# Altium schematic sheet CONNECTION.SchDoc
size A; SheetNumber: 1; SheetTotal: 2
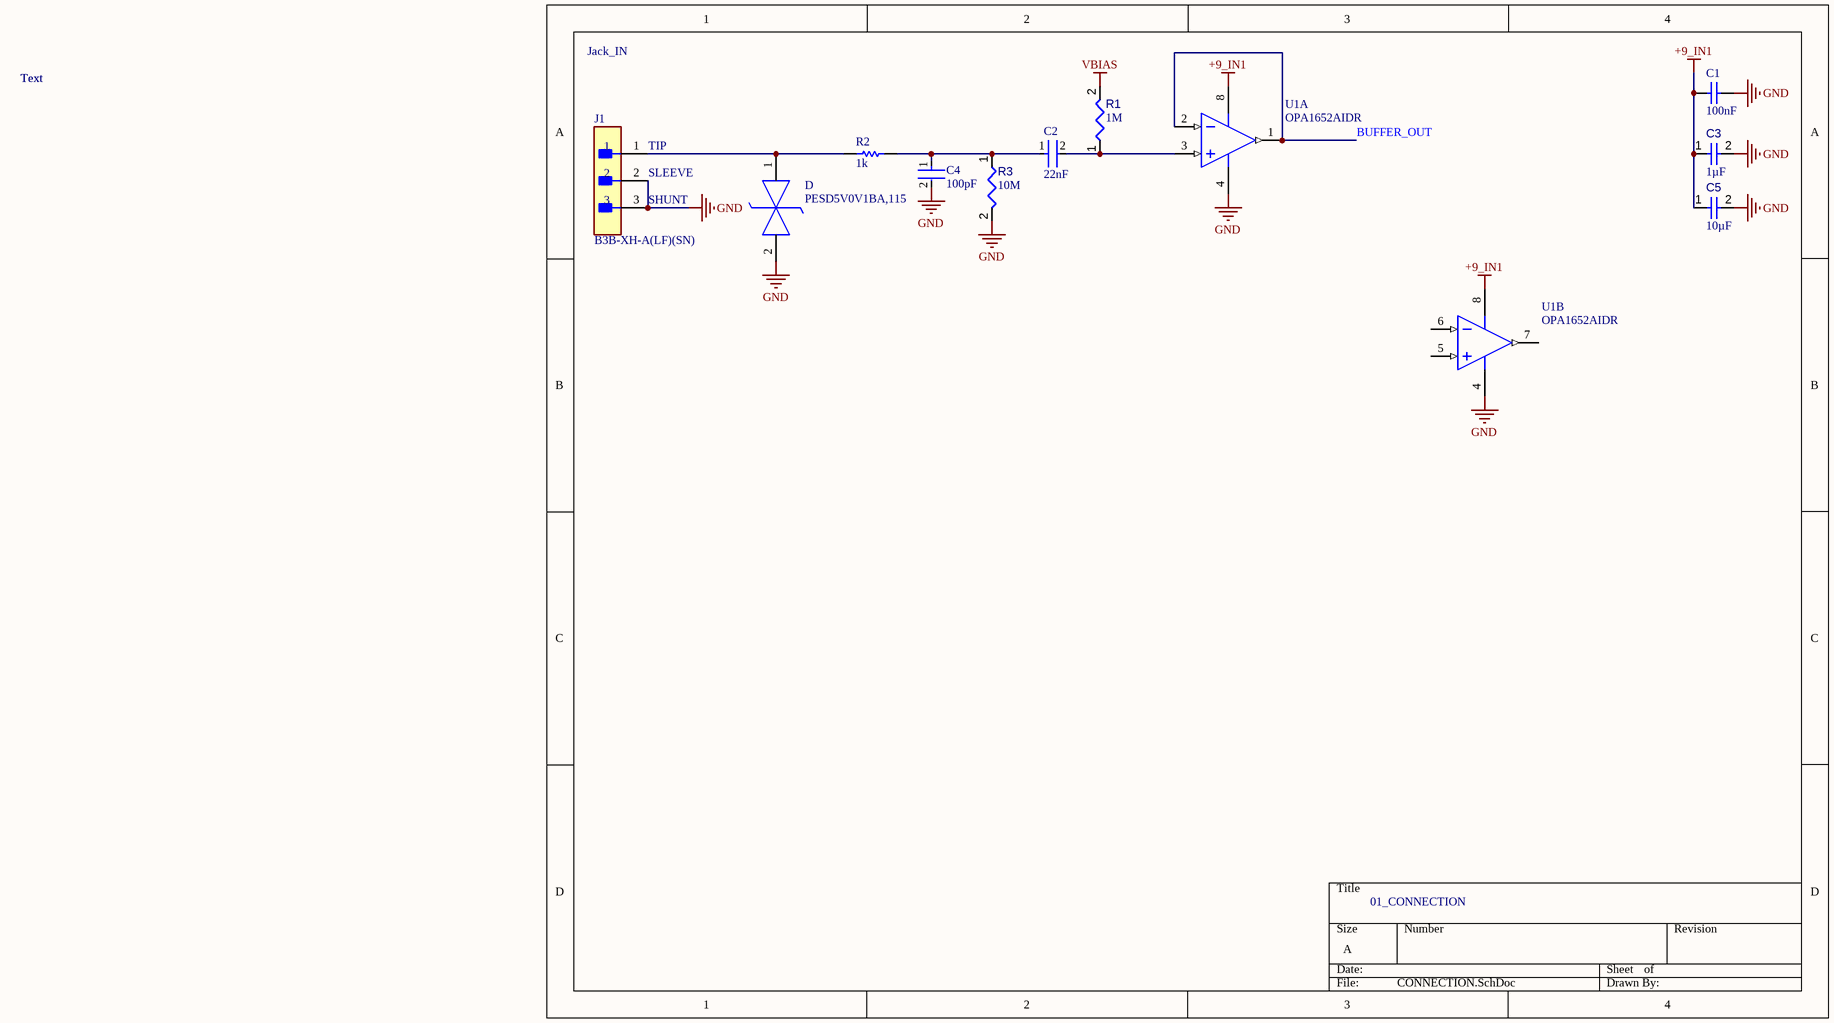
[diagram p0: CONNECTION.SchDoc]

## Parts
C1  value 100nF  [KEMT-1206-2_N]  (hidden comment: C1206C104K5RACTU)
C2  value 22nF  [FP-C1206C-EB-MFG]  (hidden comment: C1206C223J5GACTU)
C3  value 1µF  [CAPC3216X180X20ML20]  (hidden comment: Capacitor 1 uF +/- 10% 25 V 1206)
C4  value 100pF  [FP-C1206C-EB-MFG]  (hidden comment: C1206C101J5GACTU)
C5  value 10µF  [CAPC3216X180X50NL20T25]  (hidden comment: Capacitor 10 uF +/- 10% 16 V 1206)
D  PESD5V0V1BA,115  [PESD5V0V1BA,115-Footprint-1]
J1  B3B-XH-A(LF)(SN)  [FP-B3B-XH-A_LF_SN-MFG]
R1  value 1M  [RC1206FR-071ML-Footprint-1]  (hidden comment: RC1206FR-071ML)
R2  value 1k  [RESC3116X70X50ML13T20]  (hidden comment: Resistor 1k +/-1% 1206 250 mW)
R3  value 10M  [RC1206FR-0710ML-Footprint-1]  (hidden comment: RC1206FR-0710ML)
U1  OPA1652AIDR  [D0008A_N]  (parts A,B of 2)

## Nets
+9_IN1: C1.2 C3.1 C5.1 U1.8(V+)
GND: C1.1 C3.2 C4.2 C5.2 D.2(K2) J1.2 J1.3 R3.2 U1.4(V-)
VBIAS: R1.2
BUFFER_OUT: U1.1(OUT_A) U1.2(IN_A-)
NetC2_1: C2.1 C4.1 R2.2 R3.1
NetC2_2: C2.2 R1.1 U1.3(IN_A+)
NetD_1: D.1(K1) J1.1 R2.1

Not connected (* = marked no-connect by the designer): U1 5(IN_B+) 6(IN_B-) 7(OUT_B)

## Notes on the sheet
- Text
- Jack_IN
- (near J1) TIP
- (near J1) SLEEVE
- (near J1) SHUNT
- 01_CONNECTION

## Library data of the parts
C1 = CMP-001-00104-1: Multilayer Ceramic Capacitors MLCC - SMD/SMT 50V 0.1uF X7R 1206 10%; Case/Package: 1206; Max Operating Temperature: 125°C; Pins: 2; Min Operating Temperature: -55°C; Mounting Technology: Surface Mount; Voltage Rating: 50V; Tolerance: 10%
C2 = CMP-001-00103-1: 1206 (3216METRIC) Ceramic Capacitor SMD Comm C0G 50V 0.022MUF ±5% C0G NP0; Pins: 2; Min Operating Temperature: -55°C; Tolerance: 5%; Voltage Rating: 50V; Max Operating Temperature: 125°C; Case/Package: 1206; Mounting Technology: Surface Mount
C3 = CMP-001-00006-6: Chip Capacitor, 1 uF, +/- 10%, 25 V, 1206 (3216 Metric); Capacitor Type: Ceramic; Voltage Rating: 25V; Tolerance: 10%; Min Operating Temperature: -55°C; Pins: 2; Case/Package: 1206; Max Operating Temperature: 125°C; Mounting Technology: SM; RoHS Compliant: True
C4 = CMP-001-00102-1: Multilayer Ceramic Capacitor, 100 pF, 50 V, ± 5%, C0G (NP0), 1206 [3216 Metric]; Voltage Rating: 50V; Min Operating Temperature: -55°C; Tolerance: 5%; Mounting Technology: Surface Mount; Case/Package: 1206; Max Operating Temperature: 125°C; Pins: 2
C5 = CMP-001-00016-6: Chip Capacitor, 10 uF, +/- 10%, 16 V, 1206 (3216 Metric); Capacitor Type: Ceramic; Voltage Rating: 16V; Tolerance: 10%; Min Operating Temperature: -55°C; Pins: 2; Mounting Technology: SM; Case/Package: 1206; Max Operating Temperature: 125°C; RoHS Compliant: True
D = CMP-004-00039-1: ESD protection diodes / TVS diodes; NEXPERIA; PESD5V0V1BA, 115; 12.5 V; 4.8 A; 5 V; 5.8 V; Max Operating Temperature: 150°C; Mounting Technology: Surface Mount; Pins: 2; Min Operating Temperature: -55°C
J1 = CMP-002-00074-1: Connector Header, XH Series, 3 Position, 2.50mm, Through Hole, Press-Fit, Solder, Natural; Voltage Rating: 250V; Gender: Male; Connector Type: Male Pin; Max Current Rating: 3A; Pins: 3; Min Operating Temperature: -25°C; Mounting Technology: Through Hole; Max Operating Temperature: 85°C
R1 = CMP-009-00186-1: Res Thick Film 1206 1M Ohm 1% 0.25W(1/4W) ±100ppm/C Pad SMD T/R; Voltage Rating: 200V; Tolerance: 1%; Max Operating Temperature: 155°C; Case/Package: 1206; Mounting Technology: Surface Mount; Min Operating Temperature: -55°C; Pins: 2
R2 = CMP-009-00011-5: Chip Resistor, 1 KOhm, +/- 1%, 0.25 W, -55 to 155 degC, 1206 (3216 Metric); Voltage Rating: 200V; Power: 250mW; Max Operating Temperature: 155°C; Mounting Technology: SM; Tolerance: 1%; Case/Package: 1206; RoHS Compliant: True; Min Operating Temperature: -55°C; Pins: 2
R3 = CMP-009-00185-1: 250mW Thick Film Resistors 200V ±100ppm/℃ ±1% 10MΩ 1206 Chip Resistor - Surface Mount ROHS; Voltage Rating: 200V; Case/Package: 1206; Tolerance: 1%; Min Operating Temperature: -55°C; Pins: 2; Mounting Technology: Surface Mount; Max Operating Temperature: 155°C
U1 = CMP-014-00008-1: IC AUDIO 2 CIRCUIT 8SOIC Audio Amplifier 2 Circuit Rail-to-Rail 8-SOIC; Min Supply Voltage: 4.5V; Max Supply Voltage: 36V; Nominal Gain Bandwidth Product: 18MHz; Pins: 8; Max Operating Temperature: 85°C; Min Operating Temperature: -40°C; Case/Package: SOIC